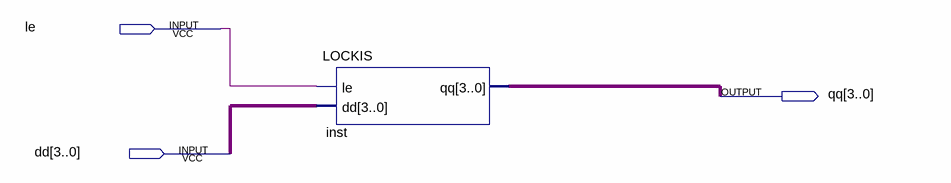
[diagram p0: schematic sheet]
// Quartus schematic LOCKIS1.bdf as structural Verilog: 1 symbols, 3 pins
module LOCKIS1 (
  input  le,
  input  [3:0] dd,
  output [3:0] qq
);

  LOCKIS inst (.le(le), .dd(dd), .qq(qq));
endmodule
